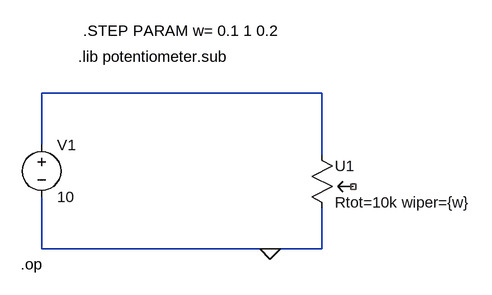
[diagram p0: schematic Draft 1a.asc]
Draft 1a.asc, the LTspice schematic file:
Version 4
SHEET 1 1024 680
WIRE 768 256 336 256
WIRE 336 336 336 256
WIRE 768 352 768 256
WIRE 336 496 336 416
WIRE 688 496 336 496
WIRE 768 496 768 432
WIRE 768 496 688 496
FLAG 688 496 0
SYMBOL potentiometer 752 336 R0
SYMATTR InstName U1
SYMATTR Value Rtot=10k wiper={w}
SYMBOL voltage 336 320 R0
SYMATTR InstName V1
SYMATTR Value 10
TEXT 392 200 Left 0 !.lib potentiometer.sub
TEXT 304 520 Left 0 !.op
TEXT 400 160 Left 0 !.STEP PARAM w= 0.1 1 0.2

The netlist it stands for:
* Draft 1a.asc
XU1 N001 0 NC_01 potentiometer Rtot=10k wiper={w}  ; pins A B C
V1 N001 0 10
.lib potentiometer.sub
.op
.STEP PARAM w= 0.1 1 0.2
.backanno
.end